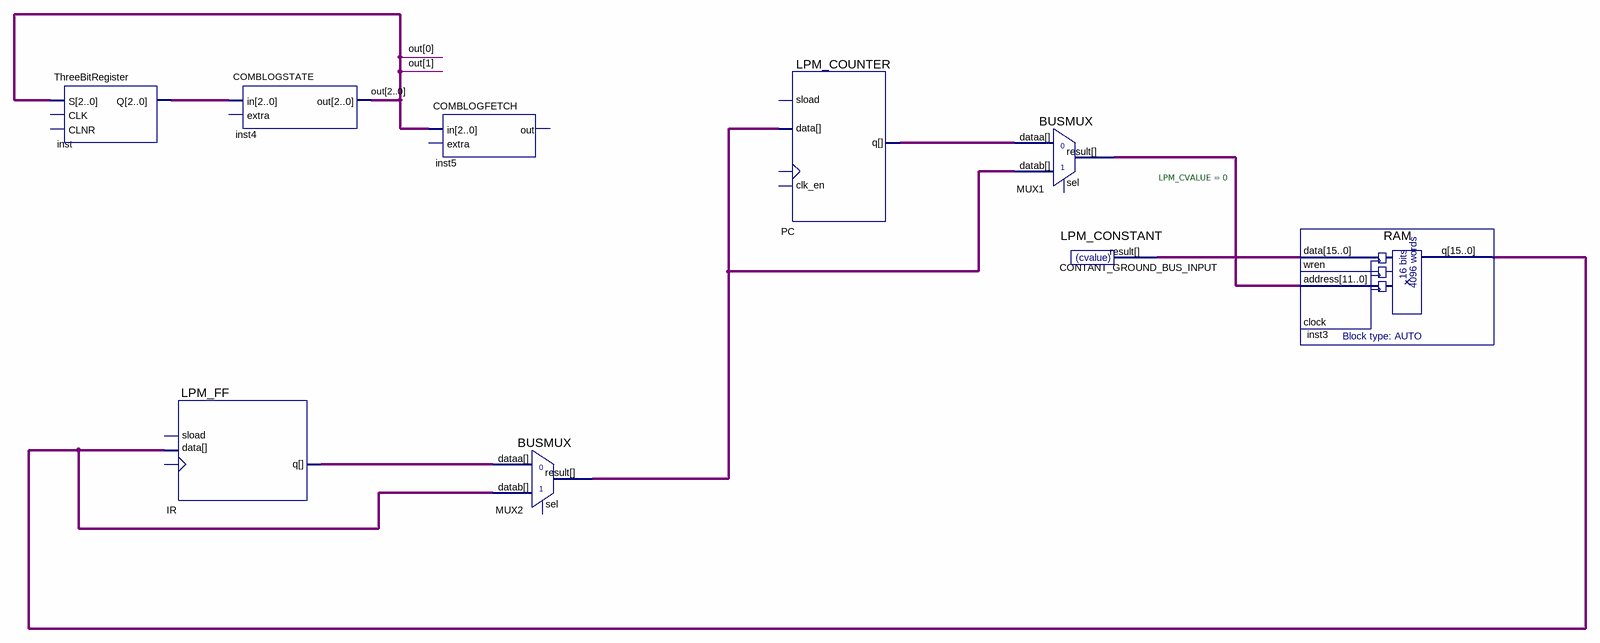
[diagram p0: schematic sheet]
// Quartus schematic TASK3.bdf as structural Verilog: 9 symbols, 0 pins
module TASK3 (
);

  wire IR_q, MUX2_result, PC_q;
  wire [2:0] inst_q, out;
  wire [11:0] MUX1_result;
  wire [15:0] CONTANT_GROUND_BUS_INPUT_result, inst3_q;

  ThreeBitRegister inst (.S(out), .Q(inst_q));  // open: CLK, CLNR
  LPM_FF IR (.data(inst3_q), .q(IR_q));  // open: clock, sload
  COMBLOGSTATE inst4 (.in(inst_q), .out(out));  // open: extra
  COMBLOGFETCH inst5 (.in(out));  // open: extra, out
  BUSMUX MUX2 (.datab(inst3_q), .dataa(IR_q), .result(MUX2_result));  // open: sel
  LPM_COUNTER PC (.data(MUX2_result), .q(PC_q));  // open: clk_en, clock, sload
  BUSMUX MUX1 (.datab(MUX2_result), .dataa(PC_q), .result(MUX1_result));  // open: sel
  LPM_CONSTANT #(.LPM_CVALUE(0)) CONTANT_GROUND_BUS_INPUT (.result(CONTANT_GROUND_BUS_INPUT_result));
  RAM inst3 (.data(CONTANT_GROUND_BUS_INPUT_result), .address(MUX1_result), .q(inst3_q));  // open: wren, clock
endmodule
